# Altium project NFC.PrjPcb
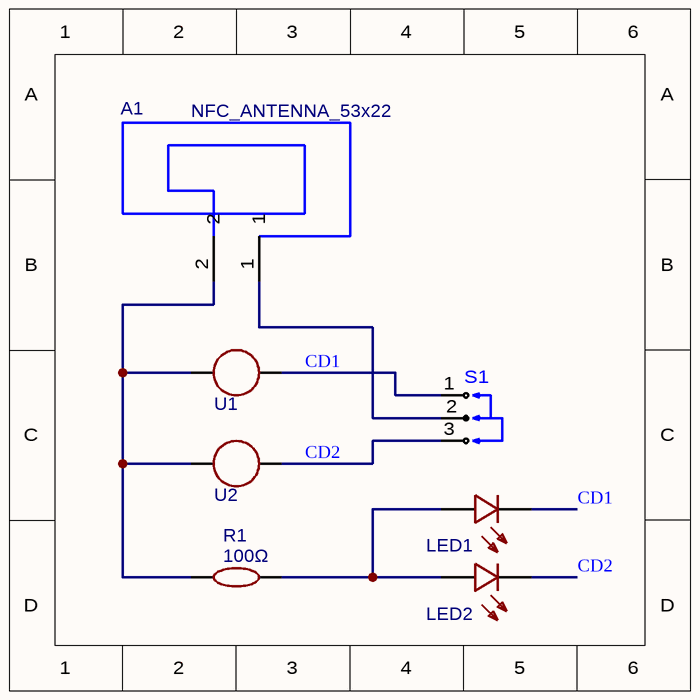
[diagram p0: NFC_SCH.schdoc]
1 sheet, 7 parts. Net scope: global (net labels, ports and power ports of the same name join across sheets).
Board file: NPC_PCB.PcbDoc

## Sheet NFC_SCH.schdoc
size 76 x 76 mm; SheetNumber: 1; SheetTotal: 1

### Parts
A1  NFC_ANTENNA_53x22  [NFC_ANTENNA_53X22]
LED1  BL-HB337A-AV-TRB  [LED 0805R]  (value not drawn)
LED2  BL-HB337A-AV-TRB  [LED 0805R]  (value not drawn)
R1  100Ω  [R 0805_L]
S1  (no value)  [KEY]
U1  NFC Chip  [COB-213]  (value not drawn)
U2  NFC Chip  [COB-213]  (value not drawn)

### Nets
CD1: LED1.1(K) S1.1 U1.2
CD2: LED2.1(K) S1.3 U2.2
NetA1_1: A1.1 S1.2
NetA1_2: A1.2 R1.1 U1.1 U2.1
NetLED1_2: LED1.2(A) LED2.2(A) R1.2

### Library data of the parts
A1 = NFC_ANTENNA_53x22: Contributor: Lockon; spicePre: U; spiceSymbolName: NFC_ANTENNA_53x22
LED1 LED2 = BL-HB337A-AV-TRB: BOM_Manufacturer: BrtLed; Contributor: LCSC; BOM_Supplier: LCSC; BOM_Manufacturer Part: BL-HB337A-AV-TRB; BOM_Supplier Part: C165977; BOM_JLCPCB Part Class: Extended Part; spicePre: L; spiceSymbolName: BL-HB337A-AV-TRB
R1 = 100Ω: BOM_Manufacturer: UniOhm; BOM_Manufacturer Part: 0402WGF1000TCE; nameAlias: Resistance; Resistance (Ohms): 100; BOM_Supplier: LCSC; BOM_Supplier Part: C25076; BOM_JLCPCB Part Class: Basic Part; spicePre: R; spiceSymbolName: 0402WGF1000TCE
S1 = SS12D10G4 071
U1 U2 = NFC Chip: BOM_Manufacturer: UniOhm; BOM_Manufacturer Part: 0603WAF1002T5E; nameAlias: Resistance; Resistance (Ohms): 10K; BOM_Supplier: LCSC; BOM_Supplier Part: C25804; BOM_JLCPCB Part Class: Basic Part; spicePre: R; spiceSymbolName: 0603WAF1002T5E